# EAGLE design lora-rx (EAGLE 7.7.0)
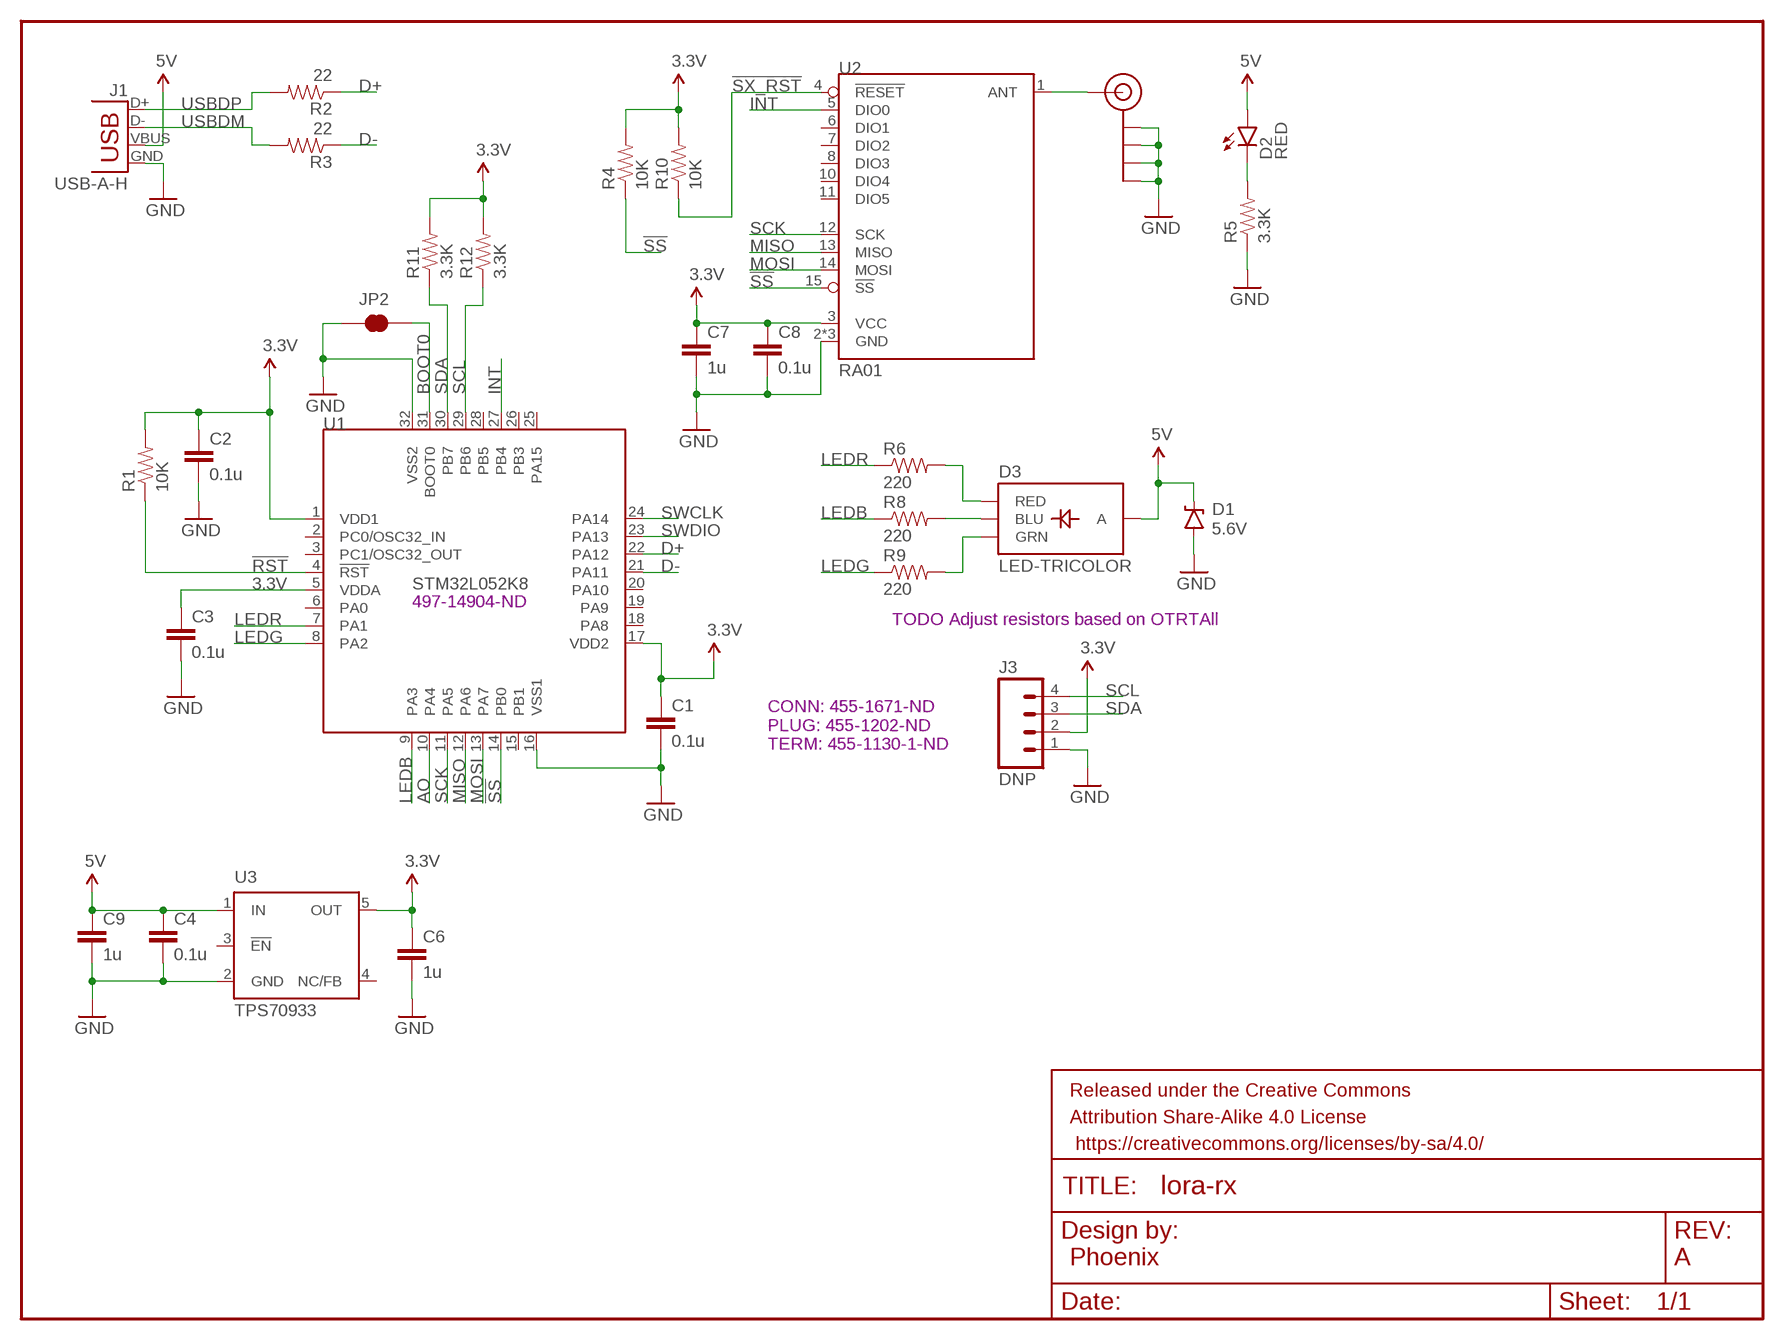
[diagram p0: schematic, sheet 1]

## Parts
C1  0.1u  CAP0805  [0805]
C2  0.1u  CAP0805  [0805]
C3  0.1u  CAP0805  [0805]
C4  0.1u  CAP0805  [0805]
C6  1u  CAP0805  [0805]
C7  1u  CAP0805  [0805]
C8  0.1u  CAP0805  [0805]
C9  1u  CAP0805  [0805]
D1  5.6V  DIODE-ZENER5.6V  [SOD-323]
D2  RED  LED-RED0603  [LED-0603]
D3  LED-TRICOLOR  [LED-TRICOLOR-SMD]
FRAME1  FRAME-LETTERNO_PACKAGE  [DUMMY]
J1  USB-A-H  [USB-A-H]
J2  SMA_EDGE  [SMA-EDGE]
J3  DNP  M04JST  [1X04-1.5MM_JST]
JP2  JUMPER-SMT_2_NC_TRACE_NO-SILK  [SMT-JUMPER_2_NC_TRACE_NO-SILK]
R1  10K  RESISTOR0805-RES  [0805]
R2  22  RESISTOR0805-RES  [0805]
R3  22  RESISTOR0805-RES  [0805]
R4  10K  RESISTOR0805-RES  [0805]
R5  3.3K  RESISTOR0805-RES  [0805]
R6  220  RESISTOR0805-RES  [0805]
R8  220  RESISTOR0805-RES  [0805]
R9  220  RESISTOR0805-RES  [0805]
R10  10K  RESISTOR0805-RES  [0805]
R11  3.3K  RESISTOR0805-RES  [0805]
R12  3.3K  RESISTOR0805-RES  [0805]
U1  STM32L052K8  STM32L05K  [TQFP32-08]
U2  RA01  [RA01]
U3  TPS70933  TPS77033  [SOT23-DBV]

## Nets
3.3V: C1.1 C2.1 C3.1 C6.1 C7.1 C8.1 J3.2 R1.2 R4.2 R10.2 R11.2 R12.2 U1.1(VDD1) U1.5(VDDA) U1.17(VDD2) U2.3(VCC) U3.5(OUT)
5V: C4.1 C9.1 D1.C D2.A D3.A J1.VBUS U3.1(IN)
!RST!: R1.1 U1.4(!RST!)
!SS!: R4.1 U1.14(PB0) U2.15(!SS!)
!SX_RST!: R10.1 U2.4(!RESET!)
ANT: J2.SIG(SIGNAL) U2.1(ANT)
AO: U1.10(PA4)
BL: D3.B(BLU) R8.2
BOOT0: JP2.2 U1.31(BOOT0)
D+: R2.1 U1.22(PA12)
D-: R3.1 U1.21(PA11)
GL: D3.G(GRN) R9.2
GND: C1.2 C2.2 C3.2 C4.2 C6.2 C7.2 C8.2 C9.2 D1.A J1.GND J2.GND@0(GND) J2.GND@1(GND) J2.GND@2(GND) J2.GND@3(GND) J3.1 JP2.1 R5.1 U1.16(VSS1) U1.32(VSS2) U2.2(GND) U2.9(GND) U2.16(GND) U3.2(GND)
INT: U1.27(PB4) U2.5(DIO0)
LEDB: R8.1 U1.9(PA3)
LEDG: R9.1 U1.8(PA2)
LEDR: R6.1 U1.7(PA1)
MISO: U1.12(PA6) U2.13(MISO)
MOSI: U1.13(PA7) U2.14(MOSI)
PLED: D2.C R5.2
RL: D3.R(RED) R6.2
SCK: U1.11(PA5) U2.12(SCK)
SCL: J3.4 R12.1 U1.29(PB6)
SDA: J3.3 R11.1 U1.30(PB7)
SWCLK: U1.24(PA14)
SWDIO: U1.23(PA13)
USBDM: J1.D- R3.2
USBDP: J1.D+ R2.2
Unconnected: U1.2(PC0/OSC32_IN) U1.3(PC1/OSC32_OUT) U1.6(PA0) U1.15(PB1) U1.18(PA8) U1.19(PA9) U1.20(PA10) U1.25(PA15) U1.26(PB3) U1.28(PB5) U2.6(DIO1) U2.7(DIO2) U2.8(DIO3) U2.10(DIO4) U2.11(DIO5) U3.3(!EN) U3.4(NC/FB)

## Notes on the sheet
- 497-14904-ND
- TODO Adjust resistors based on OTRTAll
- CONN: 455-1671-ND
  PLUG: 455-1202-ND
  TERM: 455-1130-1-ND
- Phoenix | A

## Library data of the parts
C1-C4 C6-C9 = SparkFun-Passives:CAP: Capacitor Standard 0603 ceramic capacitor, and 0.1" leaded capacitor.
D1 = SparkFun-DiscreteSemi:DIODE-ZENER: Zener Diode Production Part - 8199 3.4V Zener Voltage; PROD_ID: DIO-12442
D2 = SparkFun-LED:LED-RED: Assorted Red LEDs LilyPad 1206- DIO-09912 1206- DIO-00809 0603- DIO-00819 "SMART" means more efficient and expensive; PROD_ID: DIO-00819
D3 = SparkFun-LED:LED-TRICOLOR: Tri-Color LED SMD Proven layout and schematic for triple color LED in SMD package - common anode. Spark Fun Electronics SKU : COM-07844
FRAME1 = SparkFun-Aesthetics:FRAME-LETTER: Schematic Frame Standard 8.5x11 US Letter frame; DESIGNER: Nobody; VERSION: v01
J1 = SparkFun-Connectors:USB: USB Connectors USB-B-PTH is fully proven SKU : PRT-00139/CONN-08278 USB-miniB is fully proven SKU : PRT-00587 USB-A-PCB is untested. USB-A-H is throughly reviewed, but untested. Spark Fun Electronics SKU : PRT-00437 USB-B-SMT is throughly reviewed, but untested. Needs silkscreen touching up. USB-A-S has not been used/tested USB-MB-H has not been used/tested USB-MICROB has been used. CONN-09505; PROD_ID: CONN-08367
J2 = SparkFun-Connectors:SMA_EDGE: SMA Antenna Connector End launch SMA connector. The paste layer has been removed so that the connector can be hand soldered onto the board after reflow.
J3 = SparkFun-Connectors:M04: Header 4 Standard 4-pin 0.1" header. Use with straight break away headers (SKU : PRT-00116), right angle break away headers (PRT-00553), swiss pins (PRT-00743), machine pins (PRT-00117), and female headers (PRT-00115). Molex polarized connector foot print use with SKU : PRT-08231 with associated crimp pins and housings. 1MM SMD Version SKU: PRT-10208; PROD_ID: CONN-12477
JP2 = SparkFun-Jumpers:JUMPER-SMT_2_NC_TRACE: Normally closed trace jumper This jumper has a trace between two pads so it's normally closed (NC). Use a razor knife to open the connection. For best results follow the IPC guidelines for cutting traces: Cutout at least 0.063 mm (0.005 in). Remove all loose material to clean up the cut area. Seal the cut with an approved epoxy. Reapply solder to reclose the connection.
R1-R6 R8-R12 = SparkFun-Passives:RESISTOR: Resistor Basic schematic elements and footprints for 0603, 1206, and PTH resistors.
U1 = stm32xx:STM32L05*K: STM32L052K STM32 low-power L0 series microcontroller, 64 KBytes FLASH, 8 KB RAM, 32-LQFP package
U2 = HAB:RA01: RA-01 LoRA RA-01 LoRA module with external antenna
U3 = texas:TPS770*: ULTRALOW-POWER 50-mA LOW-DROPOUT LINEAR REGULATORS 50-mA Low-Dropout Regulator Source: http://focus.ti.com/lit/ds/symlink/tps77001.pdf; MF: TEXAS INSTRUMENTS; MPN: TPS77033DBVT; OC_FARNELL: 8461570; OC_NEWARK: 77C1187

## Board
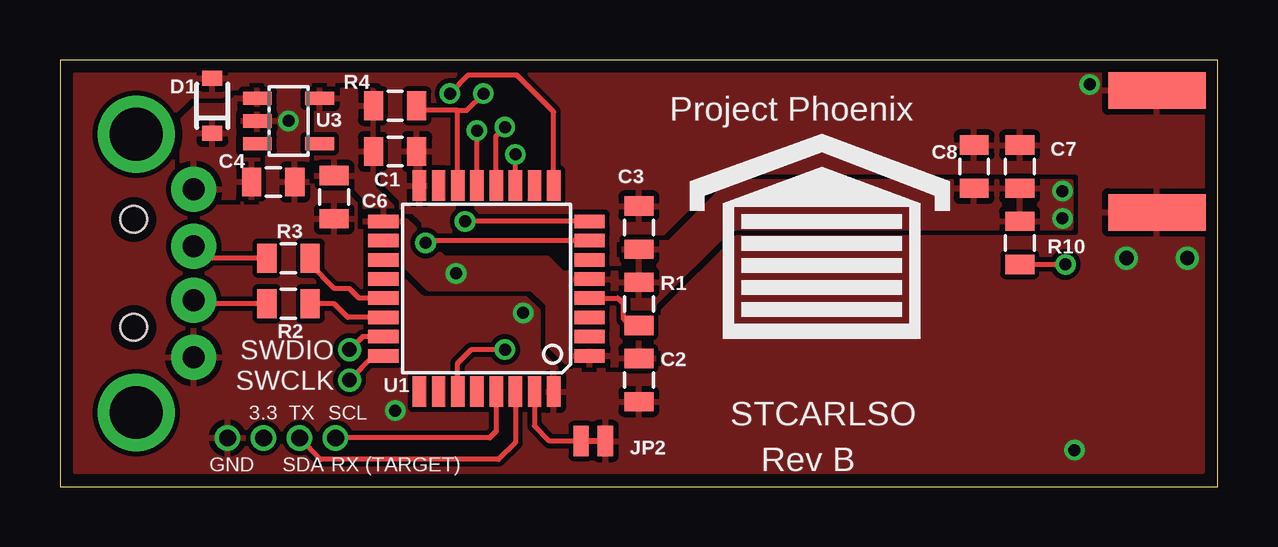
[diagram p1: board, top side]
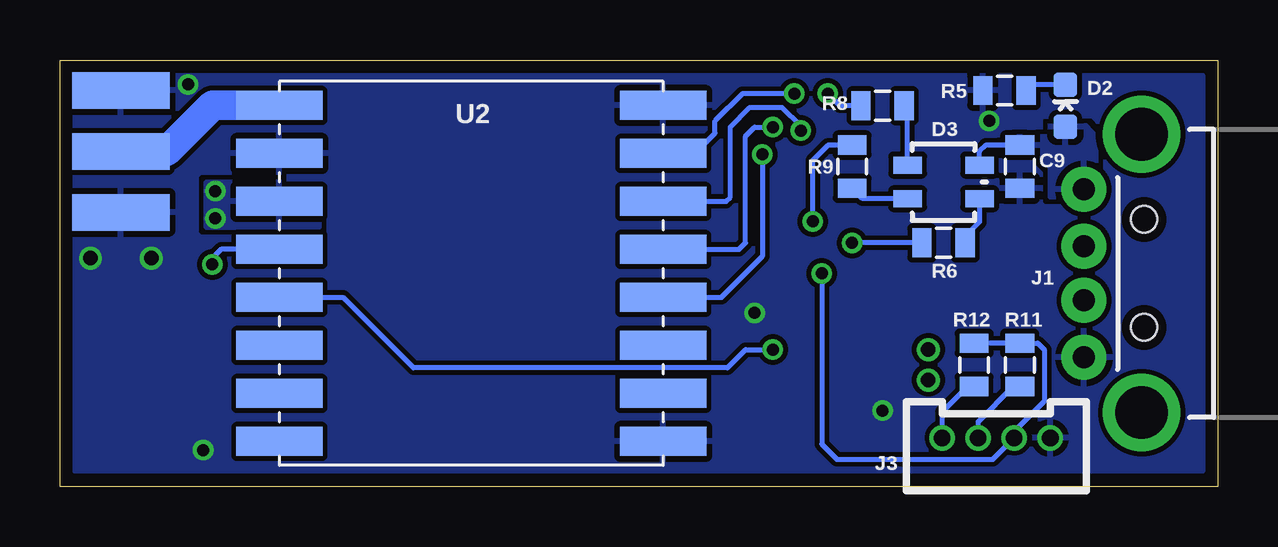
[diagram p2: board, bottom side, seen from below]

Size 48.26 x 17.78 mm. Coordinates in mm from the lower left corner, seen from the top.
Outline: 0,0 48.26,0 48.26,17.78 0,17.78 0,0
Copper layers (1*16): Top 0.0356mm / dielectric 1.5011mm / Bottom 0.0356mm
Design rules "LaenPCBOrder *": minimum track width 6mil, minimum drill 13mil, track to track 6mil, track to pad 6mil, pad to pad 6mil, via to via 6mil, smd to smd 6mil, copper to edge 15mil, drill to drill 6mil, minimum pad ring 7mil, minimum via ring 7mil, stop-mask expansion 2.5mil, vias tented up to drill 0mil, thermal gap 10mil

### Footprints (pad centres in the part's own frame; a part is rotated, then mirrored left to right if it is on the bottom)
0805 = smd 0.8 x 1.2: 1 -0.9,0; 2 0.9,0
SOD-323 = smd 0.63 x 0.83: A 1.15,0; C -1.15,0
LED-0603 = smd 1 x 1: A 0,-0.877; C 0,0.877
LED-TRICOLOR-SMD = smd 0.7 x 1.2: A 0.7,-1.5; B 0.7,1.5; G -0.7,1.5; R -0.7,-1.5
USB-A-H = drill 0.914 pad 1.88: D+ 2.4,1.127; D- 2.4,-1.127; GND 2.4,3.5; VBUS 2.4,-3.5 | drill 2.2: GND2 0,-5.8; GND3 0,5.8 | hole 1.1: -0.1,2.25; -0.1,-2.25
SMA-EDGE = smd 1.524 x 4.064: GND@0 0,0; GND@1 5.08,0; SIG 2.54,0 | smd 1.524 x 4.064 bottom: GND@2 0,0; GND@3 5.08,0
1X04-1.5MM_JST = drill 0.7: 1 0,0; 2 1.5,0; 3 3,0; 4 4.5,0
SMT-JUMPER_2_NC_TRACE_NO-SILK = smd 0.635 x 1.27: 1 -0.508,0; 2 0.508,0
TQFP32-08 = smd 1.27 x 0.559: 1 -4.293,2.8; 2 -4.293,2; 3 -4.293,1.2; 4 -4.293,0.4; 5 -4.293,-0.4; 6 -4.293,-1.2; 7 -4.293,-2; 8 -4.293,-2.8; 17 4.293,-2.8; 18 4.293,-2; 19 4.293,-1.2; 20 4.293,-0.4; 21 4.293,0.4; 22 4.293,1.2; 23 4.293,2; 24 4.293,2.8 | smd 0.559 x 1.27: 9 -2.8,-4.293; 10 -2,-4.293; 11 -1.2,-4.293; 12 -0.4,-4.293; 13 0.4,-4.293; 14 1.2,-4.293; 15 2,-4.293; 16 2.8,-4.293; 25 2.8,4.293; 26 2,4.293; 27 1.2,4.293; 28 0.4,4.293; 29 -0.4,4.293; 30 -1.2,4.293; 31 -2,4.293; 32 -2.8,4.293
RA01 = smd 3.6 x 1.2: 1 -8,7; 2 -8,5; 3 -8,3; 4 -8,1; 5 -8,-1; 6 -8,-3; 7 -8,-5; 8 -8,-7; 9 8,-7; 10 8,-5; 11 8,-3; 12 8,-1; 13 8,1; 14 8,3; 15 8,5; 16 8,7
SOT23-DBV = smd 0.55 x 1.2: 1 -0.95,-1.3; 2 0,-1.3; 3 0.95,-1.3; 4 0.95,1.3; 5 -0.95,1.3

### Placement (x,y rotation side)
C1  13.97,13.97 0 top
C2  24.13,4.45 270 top
C3  24.13,10.79 90 top
C4  8.89,12.7 0 top
C6  11.43,12.06 270 top
C7  40.01,13.34 90 top
C8  38.1,13.34 90 top
C9  8.26,13.34 270 bottom
D1  6.35,15.88 90 top
D2  6.35,15.88 0 bottom
D3  11.43,12.7 90 bottom
FRAME1  0,19.05 0 top
J1  3.17,8.89 180 bottom
J2  45.72,11.43 90 bottom
J3  6.99,2.03 180 bottom
JP2  22.23,1.91 180 top
R1  24.13,7.62 90 top
R2  9.53,7.62 180 top
R3  9.53,9.53 180 top
R4  13.97,15.88 180 top
R5  8.89,16.51 0 bottom
R6  11.43,10.16 0 bottom
R8  13.97,15.88 0 bottom
R9  15.24,13.34 270 bottom
R10  40.01,10.16 90 top
R11  8.26,5.08 90 bottom
R12  10.16,5.08 90 bottom
U1  17.78,8.26 180 top
U2  31.11,8.89 0 bottom
U3  9.53,15.24 270 top
U$1  [GARAGE]  31.75,9.53 0 top

### Tracks (layer width: path | path; a pad name or v marks a point on that pad's centre or on a via)
3.3V  (via drill 0.5)
  Bottom 0.203: R12.2 R11.2 7.5,5.98 7.24,5.71 7.24,3.56 8.48,2.31 J3.2 9.37,1.14 15.88,1.14 16.51,1.78 v16.51,8.89
  other vias: 41.78,12.32 41.78,11.18
  pour Top (isolate 0.203): 10.67,16.51 10.67,12.7 12.06,12.7 12.7,12.06 12.7,10.92 15.37,8.26 19.68,8.26 20.32,7.62 20.32,5.97 21.21,5.08 24.77,5.08 24.77,7.62 27.94,10.79 42.16,10.79 42.16,12.7 27.94,12.7 25.4,10.16 23.5,10.16 23.5,8.89 20.95,8.89 20.32,9.53 16,9.53 13.08,12.45 13.08,16.51
  pour Bottom (isolate 0.203, rank 2): 37.47,12.7 37.47,10.79 42.16,10.79 42.16,12.7
5V
  Bottom 0.203: D3.A 9.93,13.97 9.66,14.23 C9.1
  pour Top (isolate 0.305): 5.08,15.24 5.08,12.06 8.26,12.06 8.26,16.51 7.62,16.51 6.99,15.88 5.71,15.88
  pour Bottom (isolate 0.305): 5.08,12.06 6.99,12.06 6.99,13.34 7.62,13.97 8.89,13.97 8.89,14.61 6.99,14.61 6.99,15.24 5.71,15.24 5.08,14.61
!RST!
  Top 0.203: U1.4 23.26,7.86 23.5,7.62 23.5,6.99 23.76,6.72 R1.1
!SS!  (via drill 0.5)
  Top 0.203: U1.14 16.58,15.68 | 16.58,15.68 16.95,15.68 v17.65,16.38 | 16.58,15.68 15.07,15.68 R4.1
  Bottom 0.203: U2.15 21.8,13.89 20.95,14.73 20.95,15.24 19.81,16.38 v17.65,16.38
!SX_RST!  (via drill 0.5)
  Top 0.203: R10.1 v41.91,9.26
  Bottom 0.203: v41.91,9.26 41.91,9.53 41.55,9.89 U2.4
ANT
  Bottom 1.232: U2.1 41.9,15.89 43.81,13.97 J2.SIG
BL
  Bottom 0.203: D3.B 12.93,15.73 R8.2
BOOT0
  Top 0.203: U1.31 19.78,2.54 20.41,1.91 JP2.2
D+
  Top 0.203: 10.43,7.5 R2.1 11.43,7.62 11.99,7.05 U1.22
D-
  Top 0.203: U1.21 12.46,7.86 12.06,8.26 11.43,8.26 10.43,9.26 R3.1
GL
  Bottom 0.203: D3.G 14.8,12 R9.2
GND  (via drill 0.5, 0.6)
  other vias: 9.53,15.24 19.3,7.24 13.97,3.17 46.99,9.53 44.45,9.53 42.93,16.76 42.29,1.52
  pour Top (isolate 0.203, rank 3): 0.64,17.14 0.64,0.64 47.62,0.64 47.62,17.14
  pour Bottom (isolate 0.203, rank 3): 0.64,17.14 0.64,0.64 47.62,0.64 47.62,17.14
INT  (via drill 0.5)
  Top 0.203: v18.54,5.71 17.14,5.71 16.58,5.15 U1.27
  Bottom 0.203: U2.5 36.47,7.89 33.53,4.95 20.45,4.95 19.68,5.71 v18.54,5.71
LEDB  (via drill 0.5)
  Top 0.203: U1.9 20.58,15.62 19.05,17.14 17.02,17.14 v16.26,16.38
  Bottom 0.203: R8.1 15.75,15.88 v16.26,16.38
LEDG  (via drill 0.5)
  Top 0.203: U1.8 v16.89,11.05
  Bottom 0.203: v16.89,11.05 16.89,13.6 16.25,14.23 R9.1
LEDR  (via drill 0.5)
  Top 0.203: U1.7 15.34,10.26 v15.24,10.16
  Bottom 0.203: R6.1 v15.24,10.16
MISO  (via drill 0.5)
  Top 0.203: U1.12 18.18,14.62 v18.54,14.99
  Bottom 0.203: v18.54,14.99 19.3,14.99 19.68,14.61 19.68,10.16 19.95,9.89 U2.13
MOSI  (via drill 0.5)
  Top 0.203: U1.13 v17.38,14.84
  Bottom 0.203: v17.38,14.84 17.38,15.01 18.16,15.79 19.51,15.79 20.32,14.99 20.32,12.06 20.5,11.89 U2.14
PLED
  Bottom 0.203: D2.C 7.75,16.75 R5.2
RL
  Bottom 0.203: R6.2 10.53,10.43 9.93,11.03 D3.R
SCK  (via drill 0.5)
  Top 0.203: U1.11 v18.98,13.84
  Bottom 0.203: U2.12 20.68,7.89 18.98,9.6 v18.98,13.84
SCL
  Top 0.203: U1.29 18.18,2.31 17.91,2.03 J3.4
  Bottom 0.203: J3.4 11.48,3.12 10.43,4.18 R12.1
SDA
  Top 0.203: U1.30 18.98,1.83 18.29,1.14 10.87,1.14 J3.3
  Bottom 0.203: J3.3 9.98,2.71 8.52,4.18 R11.1
SWCLK  (via drill 0.6)
  Top 0.203: U1.24 13.07,5.46 v12.06,4.45
SWDIO  (via drill 0.6)
  Top 0.203: U1.23 12.61,6.25 v12.06,5.71
USBDM
  Top 0.203: R3.2 6.07,9.53 J1.D-
USBDP
  Top 0.203: R2.2 5.72,7.62 J1.D+

### Text on the board
tPlace: Project Phoenix | SWDIO | SWCLK | 3.3 | TX | SCL | STCARLSO | GND | SDA | RX (TARGET) | Rev B